# Altium schematic sheet MCISO-S01-V00-Master.SchDoc
size A3; SheetNumber: 1; SheetTotal: 8
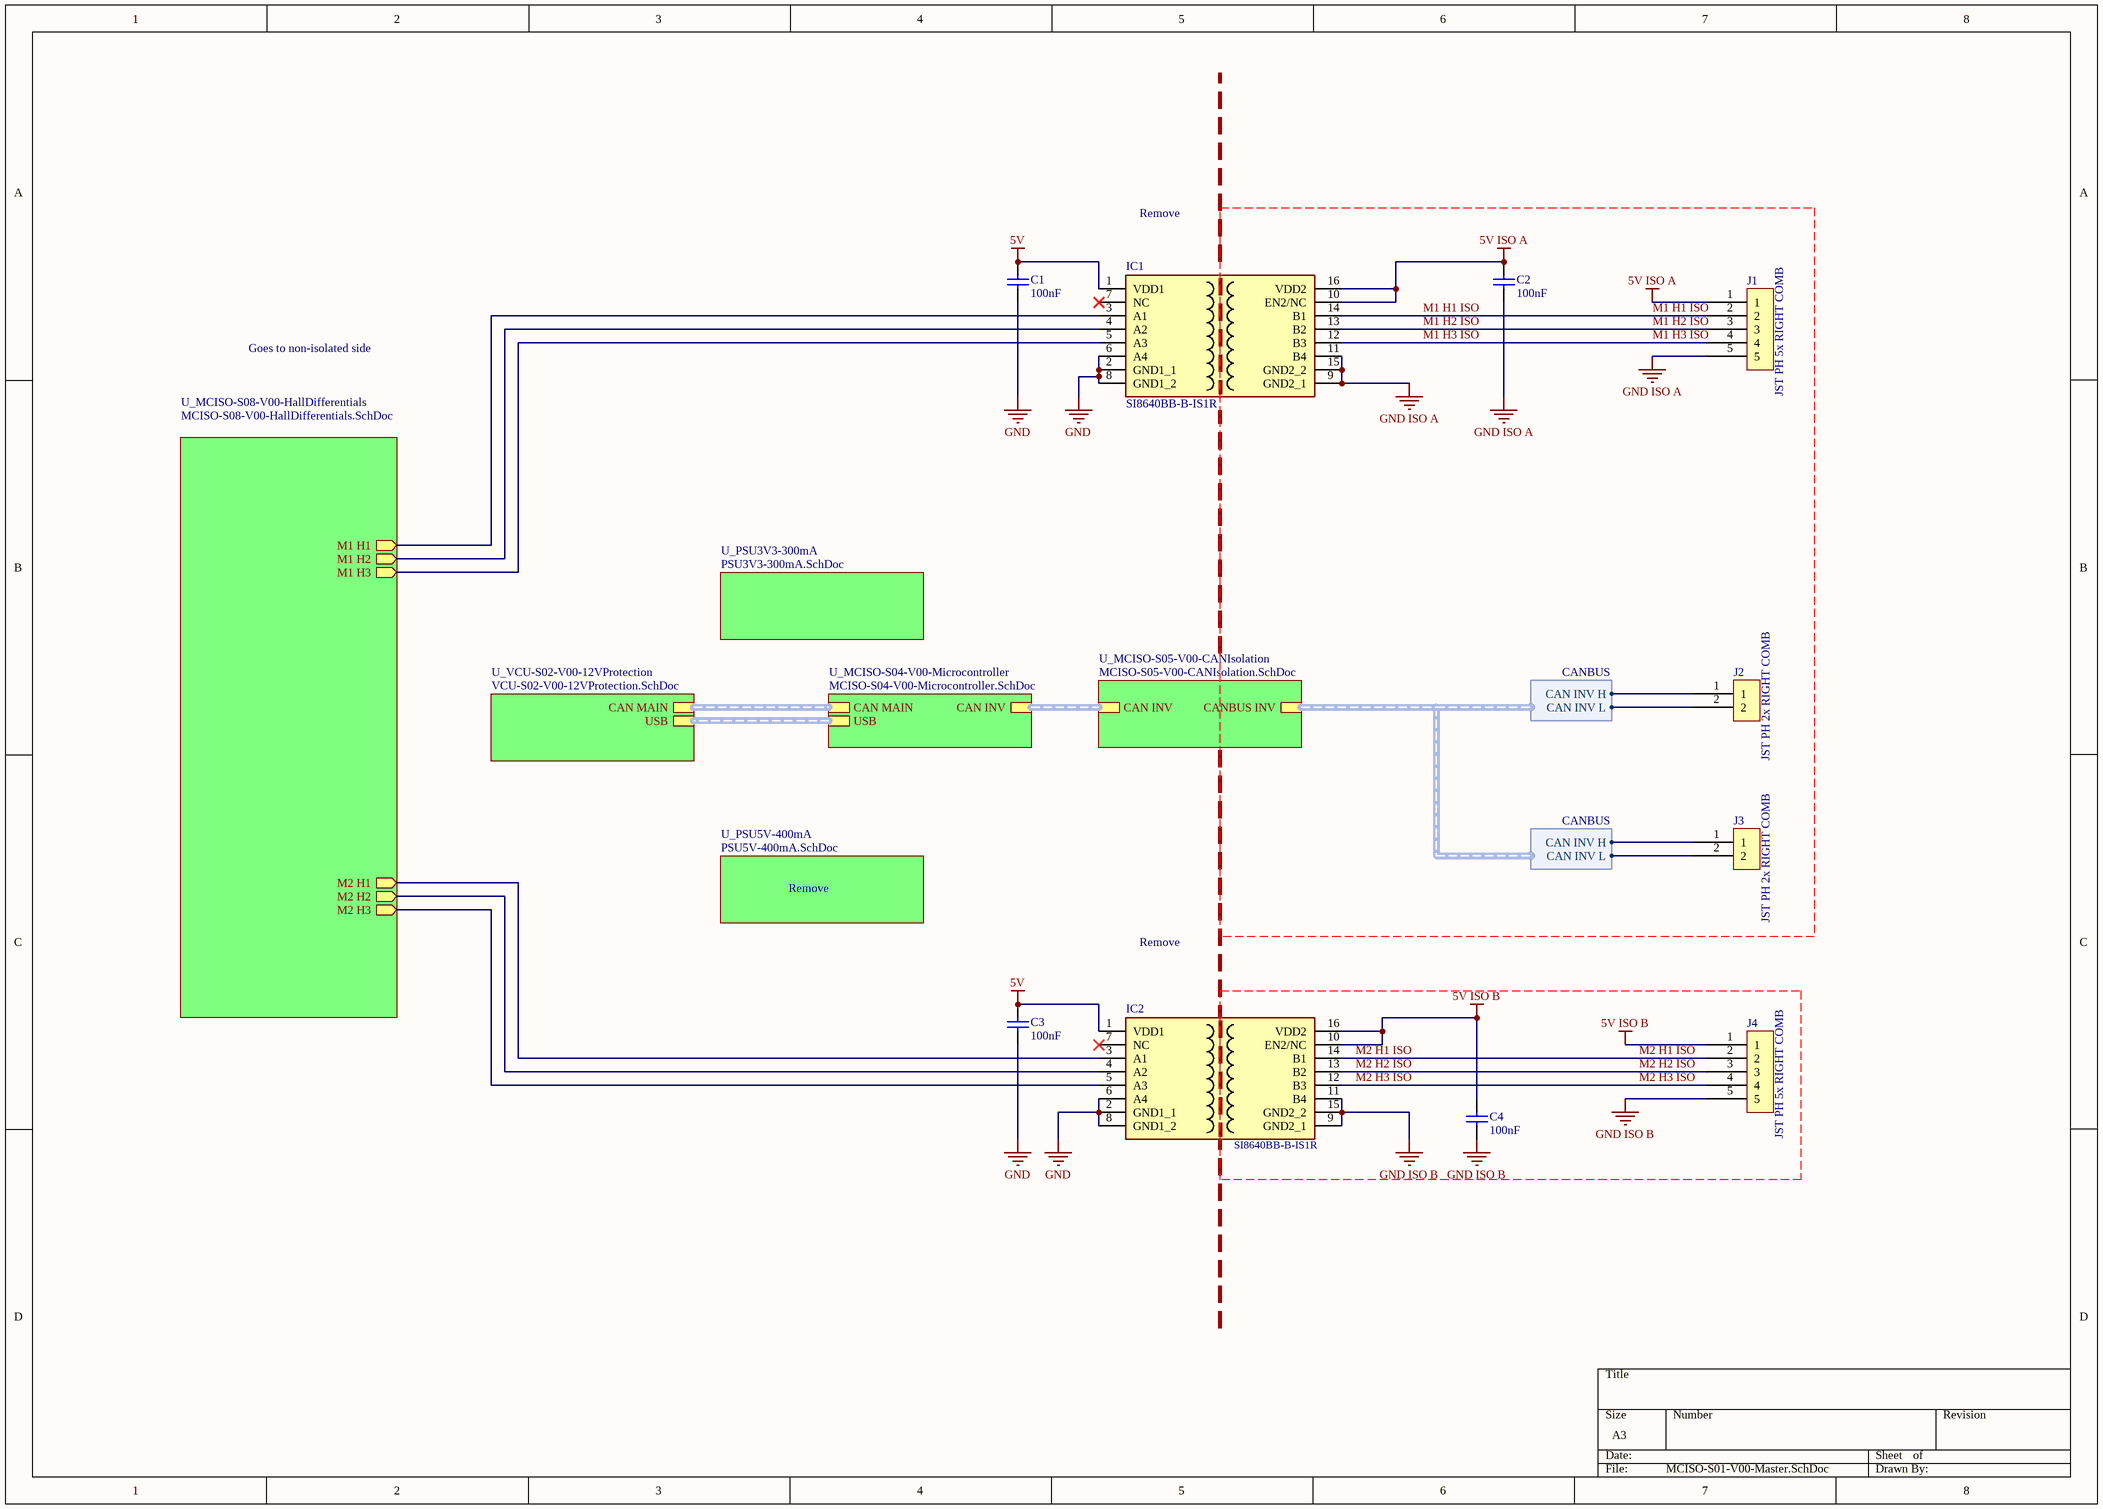
[diagram p0: MCISO-S01-V00-Master.SchDoc]

## Parts
C1  100nF  [Cap_Ceramic_0603]
C2  100nF  [Cap_Ceramic_0603]
C3  100nF  [Cap_Ceramic_0603]
C4  100nF  [Cap_Ceramic_0603]
IC1  SI8640BB-B-IS1R  [SOIC127P600X175-16N]
IC2  SI8640BB-B-IS1R  [SOIC127P600X175-16N]
J1  JST PH 5x RIGHT COMB  [JST PH 5x RIGHT COMB]
J2  JST PH 2x RIGHT COMB  [JST PH 2x RIGHT COMB]
J3  JST PH 2x RIGHT COMB  [JST PH 2x RIGHT COMB]
J4  JST PH 5x RIGHT COMB  [JST PH 5x RIGHT COMB]

## Sub-sheets
U_MCISO-S04-V00-Microcontroller = MCISO-S04-V00-Microcontroller.SchDoc: CAN MAIN (harness CAN MAIN), CAN INV (harness CAN INV), USB (harness USB-C)
U_MCISO-S05-V00-CANIsolation = MCISO-S05-V00-CANIsolation.SchDoc: CANBUS INV (harness CANBUS), CAN INV (harness CAN)
U_MCISO-S08-V00-HallDifferentials = MCISO-S08-V00-HallDifferentials.SchDoc: M2 H3 (out), M1 H3 (out), M1 H2 (out), M2 H1 (out), M2 H2 (out), M1 H1 (out)
U_PSU3V3-300mA = PSU3V3-300mA.SchDoc: no entries
U_PSU5V-400mA = PSU5V-400mA.SchDoc: no entries
U_VCU-S02-V00-12VProtection = VCU-S02-V00-12VProtection.SchDoc: USB (harness USB), CAN MAIN

## Harnesses
CANBUS: CAN INV H, CAN INV L

## Nets
5V: C1.2 C3.2 IC1.1(VDD1) IC2.1(VDD1)
5V ISO A: C2.2 IC1.10(EN2/NC) IC1.16(VDD2) J1.1
5V ISO B: C4.2 IC2.10(EN2/NC) IC2.16(VDD2) J4.1
GND: C1.1 C3.1 IC1.2(GND1_1) IC1.6(A4) IC1.8(GND1_2) IC2.2(GND1_1) IC2.6(A4) IC2.8(GND1_2)
GND ISO A: C2.1 IC1.9(GND2_1) IC1.11(B4) IC1.15(GND2_2) J1.5
GND ISO B: C4.1 IC2.9(GND2_1) IC2.11(B4) IC2.15(GND2_2) J4.5
M1 H1 ISO: IC1.14(B1) J1.2
M1 H2 ISO: IC1.13(B2) J1.3
M1 H3 ISO: IC1.12(B3) J1.4
M2 H1 ISO: IC2.14(B1) J4.2
M2 H2 ISO: IC2.13(B2) J4.3
M2 H3 ISO: IC2.12(B3) J4.4
NetIC1_3: IC1.3(A1) ; sheet U_MCISO-S08-V00-HallDifferentials/M1 H1
NetIC1_4: IC1.4(A2) ; sheet U_MCISO-S08-V00-HallDifferentials/M1 H2
NetIC1_5: IC1.5(A3) ; sheet U_MCISO-S08-V00-HallDifferentials/M1 H3
NetIC2_3: IC2.3(A1) ; sheet U_MCISO-S08-V00-HallDifferentials/M2 H1
NetIC2_4: IC2.4(A2) ; sheet U_MCISO-S08-V00-HallDifferentials/M2 H2
NetIC2_5: IC2.5(A3) ; sheet U_MCISO-S08-V00-HallDifferentials/M2 H3
NetJ2_1: J2.1 J3.1 ; sheet U_MCISO-S05-V00-CANIsolation/CANBUS INV.CAN INV H
NetJ2_2: J2.2 J3.2 ; sheet U_MCISO-S05-V00-CANIsolation/CANBUS INV.CAN INV L

Not connected (* = marked no-connect by the designer): IC1 7(NC)*; IC2 7(NC)*

## Buses and harness runs
harness sheet U_MCISO-S04-V00-Microcontroller/CAN INV = sheet U_MCISO-S05-V00-CANIsolation/CAN INV
harness sheet U_MCISO-S04-V00-Microcontroller/CAN MAIN = sheet U_VCU-S02-V00-12VProtection/CAN MAIN
harness sheet U_MCISO-S04-V00-Microcontroller/USB = sheet U_VCU-S02-V00-12VProtection/USB

## Notes on the sheet
- Remove
- Goes to non-isolated side

## Library data of the parts
C1-C4 = 100nF 50V 5% X7R 0603: Capacitor, Ceramic, SMD, 100nF, 50V, 5%, X7R, 0603
IC1 IC2 = SI8640BB-B-IS1R: Integrated Circuit; Manufacturer_Name: Silicon Labs; Datasheet Link: https://www.arrow.com/en/products/si8640bb-b-is1r/silicon-labs; Height: 1.75mm; Manufacturer_Part_Number: SI8640BB-B-IS1R; Mouser Part Number: 634-SI8640BB-B-IS1R; Mouser Price/Stock: https://www.mouser.co.uk/ProductDetail/Silicon-Labs/SI8640BB-B-IS1R?qs=j6MGy4L9yX09sv%252BEYaun9w%3D%3D; Arrow Part Number: SI8640BB-B-IS1R; Arrow Price/Stock: https://www.arrow.com/en/products/si8640bb-b-is1r/silicon-labs